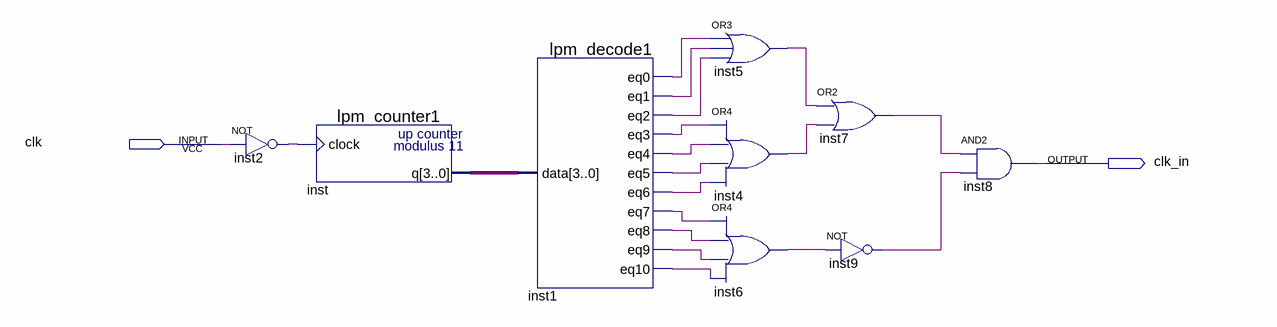
[diagram p0: schematic sheet]
// Quartus schematic laba2.bdf as structural Verilog: 9 symbols, 2 pins
module laba2 (
  input  clk,
  output clk_in
);

  wire inst1_eq0, inst1_eq1, inst1_eq2, inst1_eq3, inst1_eq4, inst1_eq5, inst1_eq6, inst1_eq7, inst1_eq8,
       inst1_eq9, inst1_eq10, inst2_out, inst4_out, inst5_out, inst6_out, inst7_out, inst9_out;
  wire [3:0] inst_q;

  not inst2 (inst2_out, clk);
  lpm_counter1 inst (.clock(inst2_out), .q(inst_q));
  lpm_decode1 inst1 (
    .data(inst_q), .eq0(inst1_eq0), .eq1(inst1_eq1), .eq2(inst1_eq2), .eq3(inst1_eq3), .eq4(inst1_eq4),
    .eq5(inst1_eq5), .eq6(inst1_eq6), .eq7(inst1_eq7), .eq8(inst1_eq8), .eq9(inst1_eq9), .eq10(inst1_eq10));
  or inst5 (inst5_out, inst1_eq0, inst1_eq1, inst1_eq2);
  or inst4 (inst4_out, inst1_eq3, inst1_eq4, inst1_eq5, inst1_eq6);
  or inst6 (inst6_out, inst1_eq7, inst1_eq8, inst1_eq9, inst1_eq10);
  or inst7 (inst7_out, inst5_out, inst4_out);
  not inst9 (inst9_out, inst6_out);
  and inst8 (clk_in, inst7_out, inst9_out);
endmodule
